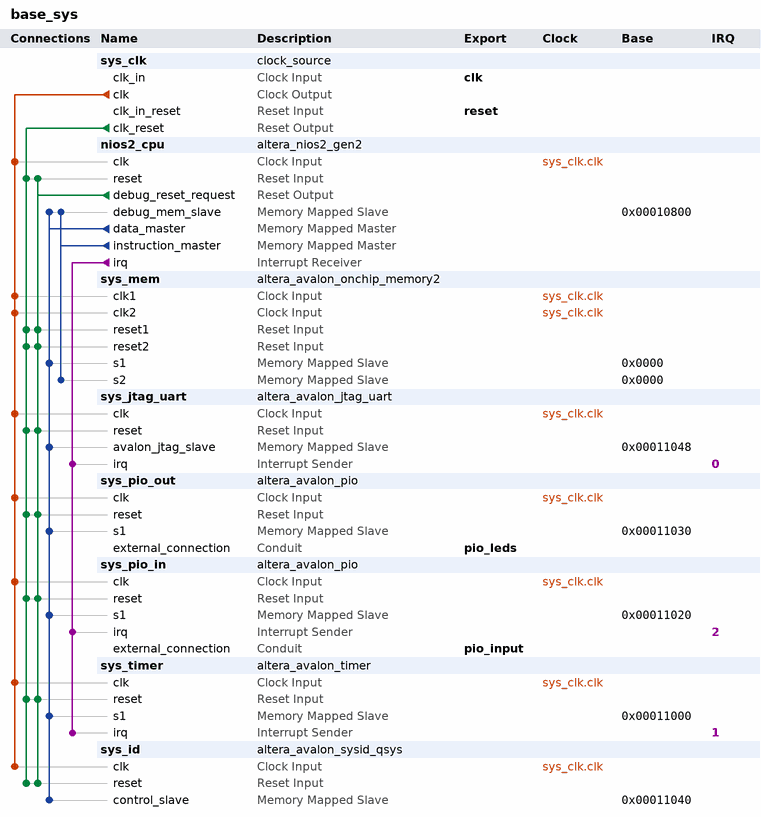
[diagram p0: system contents]
# Platform Designer (Qsys) system base_sys, MAX 10 10M50DAF484C6GES
# Parameters at their usual value, and those the tool derives, are not listed.
package require -exact qsys 18.1
create_system base_sys
set_project_property DEVICE_FAMILY {MAX 10}
set_project_property DEVICE 10M50DAF484C6GES

add_instance sys_clk clock_source 18.1
set_instance_parameter_value sys_clk clockFrequency 50000000

add_instance nios2_cpu altera_nios2_gen2 18.1
set_instance_parameter_value nios2_cpu dcache_size 2048
set_instance_parameter_value nios2_cpu exceptionSlave sys_mem.s2
set_instance_parameter_value nios2_cpu icache_size 4096
set_instance_parameter_value nios2_cpu impl Fast
set_instance_parameter_value nios2_cpu resetSlave sys_mem.s2

add_instance sys_mem altera_avalon_onchip_memory2 18.1
set_instance_parameter_value sys_mem dataWidth 32
set_instance_parameter_value sys_mem dualPort true
set_instance_parameter_value sys_mem initMemContent false
set_instance_parameter_value sys_mem initializationFileName onchip_mem.hex
set_instance_parameter_value sys_mem memorySize 40000

add_instance sys_jtag_uart altera_avalon_jtag_uart 18.1
set_instance_parameter_value sys_jtag_uart simInteractiveOptions NO_INTERACTIVE_WINDOWS

add_instance sys_pio_out altera_avalon_pio 18.1
set_instance_parameter_value sys_pio_out direction Output
set_instance_parameter_value sys_pio_out width 8

add_instance sys_pio_in altera_avalon_pio 18.1
set_instance_parameter_value sys_pio_in captureEdge true
set_instance_parameter_value sys_pio_in direction Input
set_instance_parameter_value sys_pio_in generateIRQ true
set_instance_parameter_value sys_pio_in irqType EDGE
set_instance_parameter_value sys_pio_in width 1

add_instance sys_timer altera_avalon_timer 18.1
set_instance_parameter_value sys_timer period 1
set_instance_parameter_value sys_timer periodUnits MSEC

add_instance sys_id altera_avalon_sysid_qsys 18.1
set_instance_parameter_value sys_id id 305419896

# connections
add_connection sys_clk.clk nios2_cpu.clk clock
add_connection sys_clk.clk sys_id.clk clock
add_connection sys_clk.clk sys_jtag_uart.clk clock
add_connection sys_clk.clk sys_mem.clk1 clock
add_connection sys_clk.clk sys_mem.clk2 clock
add_connection sys_clk.clk sys_pio_in.clk clock
add_connection sys_clk.clk sys_pio_out.clk clock
add_connection sys_clk.clk sys_timer.clk clock
add_connection nios2_cpu.debug_reset_request nios2_cpu.reset reset
add_connection nios2_cpu.debug_reset_request sys_id.reset reset
add_connection nios2_cpu.debug_reset_request sys_jtag_uart.reset reset
add_connection nios2_cpu.debug_reset_request sys_mem.reset1 reset
add_connection nios2_cpu.debug_reset_request sys_mem.reset2 reset
add_connection nios2_cpu.debug_reset_request sys_pio_in.reset reset
add_connection nios2_cpu.debug_reset_request sys_pio_out.reset reset
add_connection nios2_cpu.debug_reset_request sys_timer.reset reset
add_connection sys_clk.clk_reset nios2_cpu.reset reset
add_connection sys_clk.clk_reset sys_id.reset reset
add_connection sys_clk.clk_reset sys_jtag_uart.reset reset
add_connection sys_clk.clk_reset sys_mem.reset1 reset
add_connection sys_clk.clk_reset sys_mem.reset2 reset
add_connection sys_clk.clk_reset sys_pio_in.reset reset
add_connection sys_clk.clk_reset sys_pio_out.reset reset
add_connection sys_clk.clk_reset sys_timer.reset reset
add_connection nios2_cpu.data_master nios2_cpu.debug_mem_slave avalon
set_connection_parameter_value nios2_cpu.data_master/nios2_cpu.debug_mem_slave baseAddress 0x00010800
add_connection nios2_cpu.data_master sys_id.control_slave avalon
set_connection_parameter_value nios2_cpu.data_master/sys_id.control_slave baseAddress 0x00011040
add_connection nios2_cpu.data_master sys_jtag_uart.avalon_jtag_slave avalon
set_connection_parameter_value nios2_cpu.data_master/sys_jtag_uart.avalon_jtag_slave baseAddress 0x00011048
add_connection nios2_cpu.data_master sys_mem.s1 avalon
set_connection_parameter_value nios2_cpu.data_master/sys_mem.s1 baseAddress 0x0000
add_connection nios2_cpu.data_master sys_pio_in.s1 avalon
set_connection_parameter_value nios2_cpu.data_master/sys_pio_in.s1 baseAddress 0x00011020
add_connection nios2_cpu.data_master sys_pio_out.s1 avalon
set_connection_parameter_value nios2_cpu.data_master/sys_pio_out.s1 baseAddress 0x00011030
add_connection nios2_cpu.data_master sys_timer.s1 avalon
set_connection_parameter_value nios2_cpu.data_master/sys_timer.s1 baseAddress 0x00011000
add_connection nios2_cpu.instruction_master nios2_cpu.debug_mem_slave avalon
set_connection_parameter_value nios2_cpu.instruction_master/nios2_cpu.debug_mem_slave baseAddress 0x00010800
add_connection nios2_cpu.instruction_master sys_mem.s2 avalon
set_connection_parameter_value nios2_cpu.instruction_master/sys_mem.s2 baseAddress 0x0000
add_connection nios2_cpu.irq sys_jtag_uart.irq interrupt
set_connection_parameter_value nios2_cpu.irq/sys_jtag_uart.irq irqNumber 0
add_connection nios2_cpu.irq sys_pio_in.irq interrupt
set_connection_parameter_value nios2_cpu.irq/sys_pio_in.irq irqNumber 2
add_connection nios2_cpu.irq sys_timer.irq interrupt
set_connection_parameter_value nios2_cpu.irq/sys_timer.irq irqNumber 1

# exported interfaces
add_interface clk clock sink
set_interface_property clk EXPORT_OF sys_clk.clk_in
add_interface pio_input conduit end
set_interface_property pio_input EXPORT_OF sys_pio_in.external_connection
add_interface pio_leds conduit end
set_interface_property pio_leds EXPORT_OF sys_pio_out.external_connection
add_interface reset reset sink
set_interface_property reset EXPORT_OF sys_clk.clk_in_reset

set_interconnect_requirement {$system} qsys_mm.clockCrossingAdapter HANDSHAKE
set_interconnect_requirement {$system} qsys_mm.enableEccProtection FALSE
set_interconnect_requirement {$system} qsys_mm.insertDefaultSlave FALSE
set_interconnect_requirement {$system} qsys_mm.maxAdditionalLatency 1

save_system base_sys.qsys
